# EAGLE design untitled (EAGLE 9.5.1)
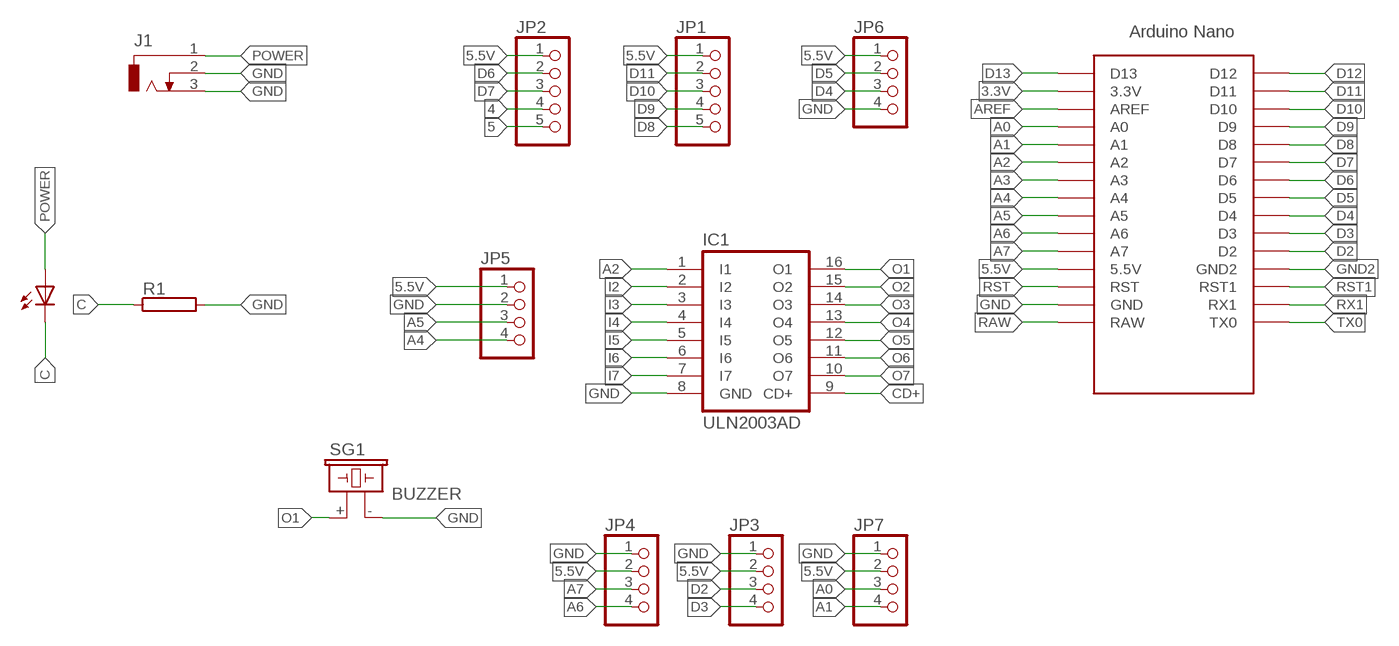
[diagram p0: schematic, sheet 1]

## Parts
IC1  ULN2003AD  [SO16]
J1  CON_JACK  [DCJ0303]
JP1  PINHD-1X5  [1X05]
JP2  PINHD-1X5  [1X05]
JP3  PINHD-1X4  [1X04]
JP4  PINHD-1X4  [1X04]
JP5  PINHD-1X4  [1X04]
JP6  PINHD-1X4  [1X04]
JP7  PINHD-1X4  [1X04]
R1  RMG100-H  [TO-247-2H]
SG1  BUZZER  [F/CM12P]
U$1  ARDUINO_NANO  [NANO]
U$2  LED5MM  [LED5MM]

## Nets
3.3V: U$1.3.3V
4: JP2.4
5: JP2.5
5.5V: JP1.1 JP2.1 JP3.2 JP4.2 JP5.1 JP6.1 JP7.2 U$1.5V(5.5V)
A0: JP7.3 U$1.A0
A1: JP7.4 U$1.A1
A2: IC1.1(I1) U$1.A2
A3: U$1.A3
A4: JP5.4 U$1.A4
A5: JP5.3 U$1.A5
A6: JP4.4 U$1.A6
A7: JP4.3 U$1.A7
AREF: U$1.AREF
C: R1.1 U$2.K(C)
CD+: IC1.9(CD+)
D2: JP3.3 U$1.D2
D3: JP3.4 U$1.D3
D4: JP6.3 U$1.D4
D5: JP6.2 U$1.D5
D6: JP2.2 U$1.D6
D7: JP2.3 U$1.D7
D8: JP1.5 U$1.D8
D9: JP1.4 U$1.D9
D10: JP1.3 U$1.D10
D11: JP1.2 U$1.D11
D12: U$1.D12
D13: U$1.D13
GND: IC1.8(GND) J1.2 J1.3 JP3.1 JP4.1 JP5.2 JP6.4 JP7.1 R1.2 SG1.- U$1.GND
GND2: U$1.GND1(GND2)
I2: IC1.2(I2)
I3: IC1.3(I3)
I4: IC1.4(I4)
I5: IC1.5(I5)
I6: IC1.6(I6)
I7: IC1.7(I7)
O1: IC1.16(O1) SG1.+
O2: IC1.15(O2)
O3: IC1.14(O3)
O4: IC1.13(O4)
O5: IC1.12(O5)
O6: IC1.11(O6)
O7: IC1.10(O7)
POWER: J1.1 U$2.A
RAW: U$1.RAW
RST: U$1.RST
RST1: U$1.RST1
RX1: U$1.RX1
TX0: U$1.TX0

## Library data of the parts
IC1 = MIA-Training:ULN2003A: DRIVER ARRAY
J1 = MIA-Training:CON_JACK: DC POWER JACK Source: DCJ0303.pdf; OC_FARNELL: unknown; OC_NEWARK: unknown
JP1 JP2 = MIA-Training:PINHD-1X5: PIN HEADER
JP3-JP7 = MIA-Training:PINHD-1X4: PIN HEADER
R1 = resistor-power:RMG100: TO-247 Power Resistor - RMG 100 Series Source: www.token.com.tw .. power-resistor-rmg100pdf; OC_FARNELL: unknown; OC_NEWARK: unknown
SG1 = MIA-Training:BUZZER: BUZZER Source: Buerklin; OC_FARNELL: unknown; OC_NEWARK: unknown
U$1 = MIA-Training:ARDUINO_NANO: Arduino Nano
U$2 = MIA-Training:LED5MM

## Board
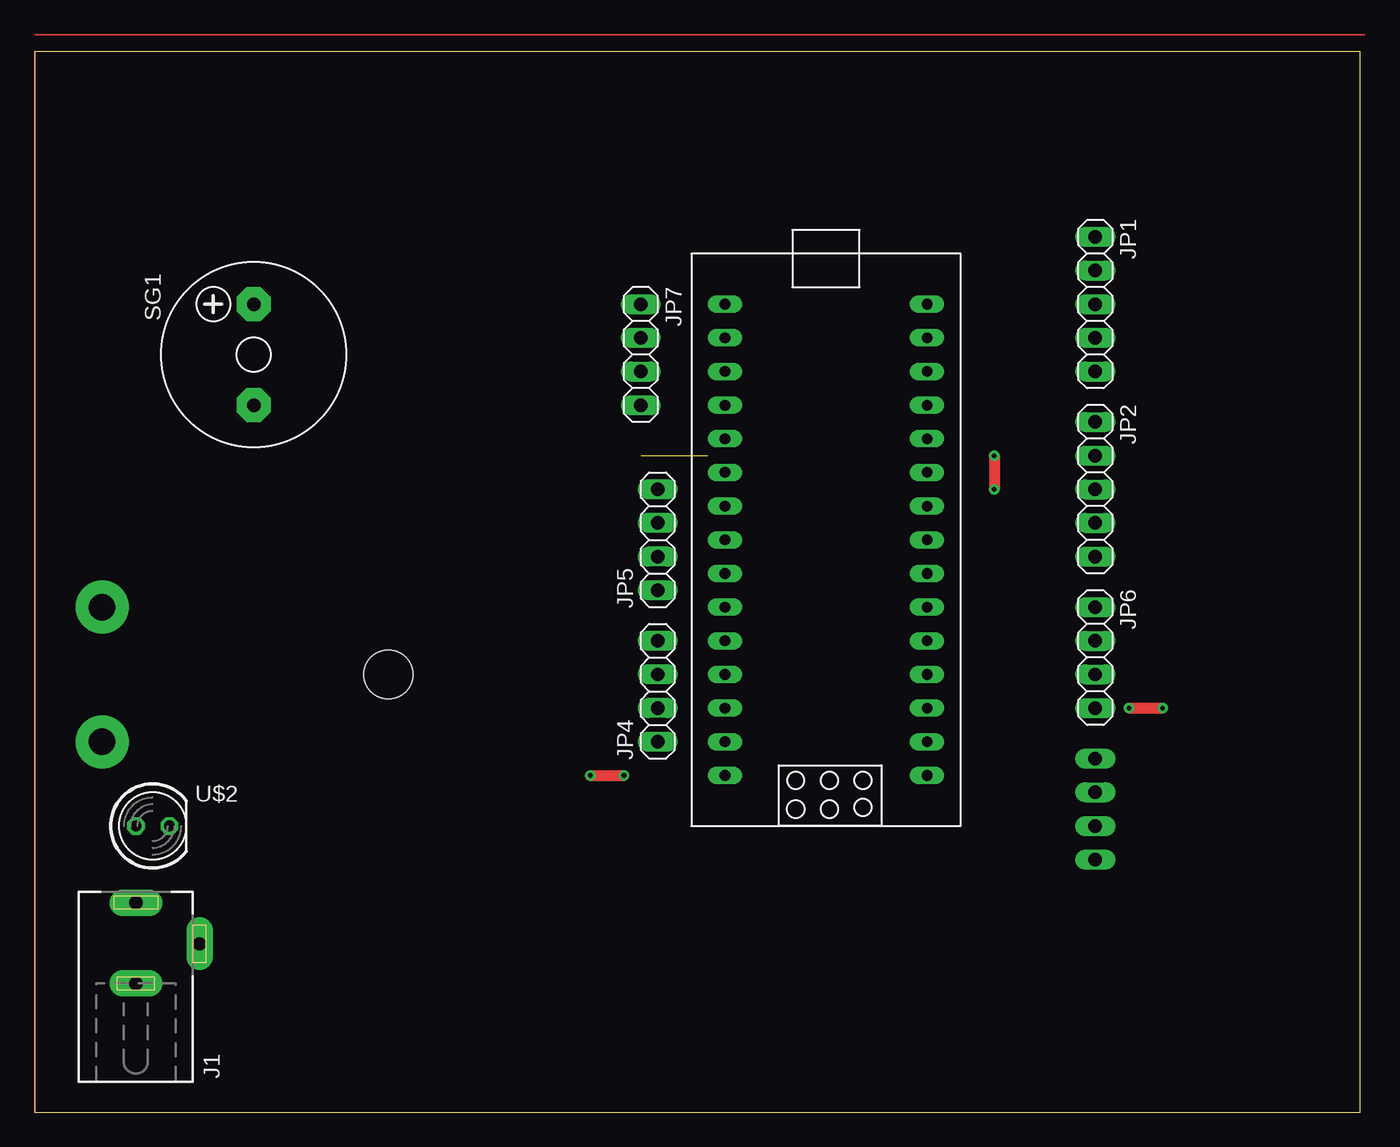
[diagram p1: board, top side]
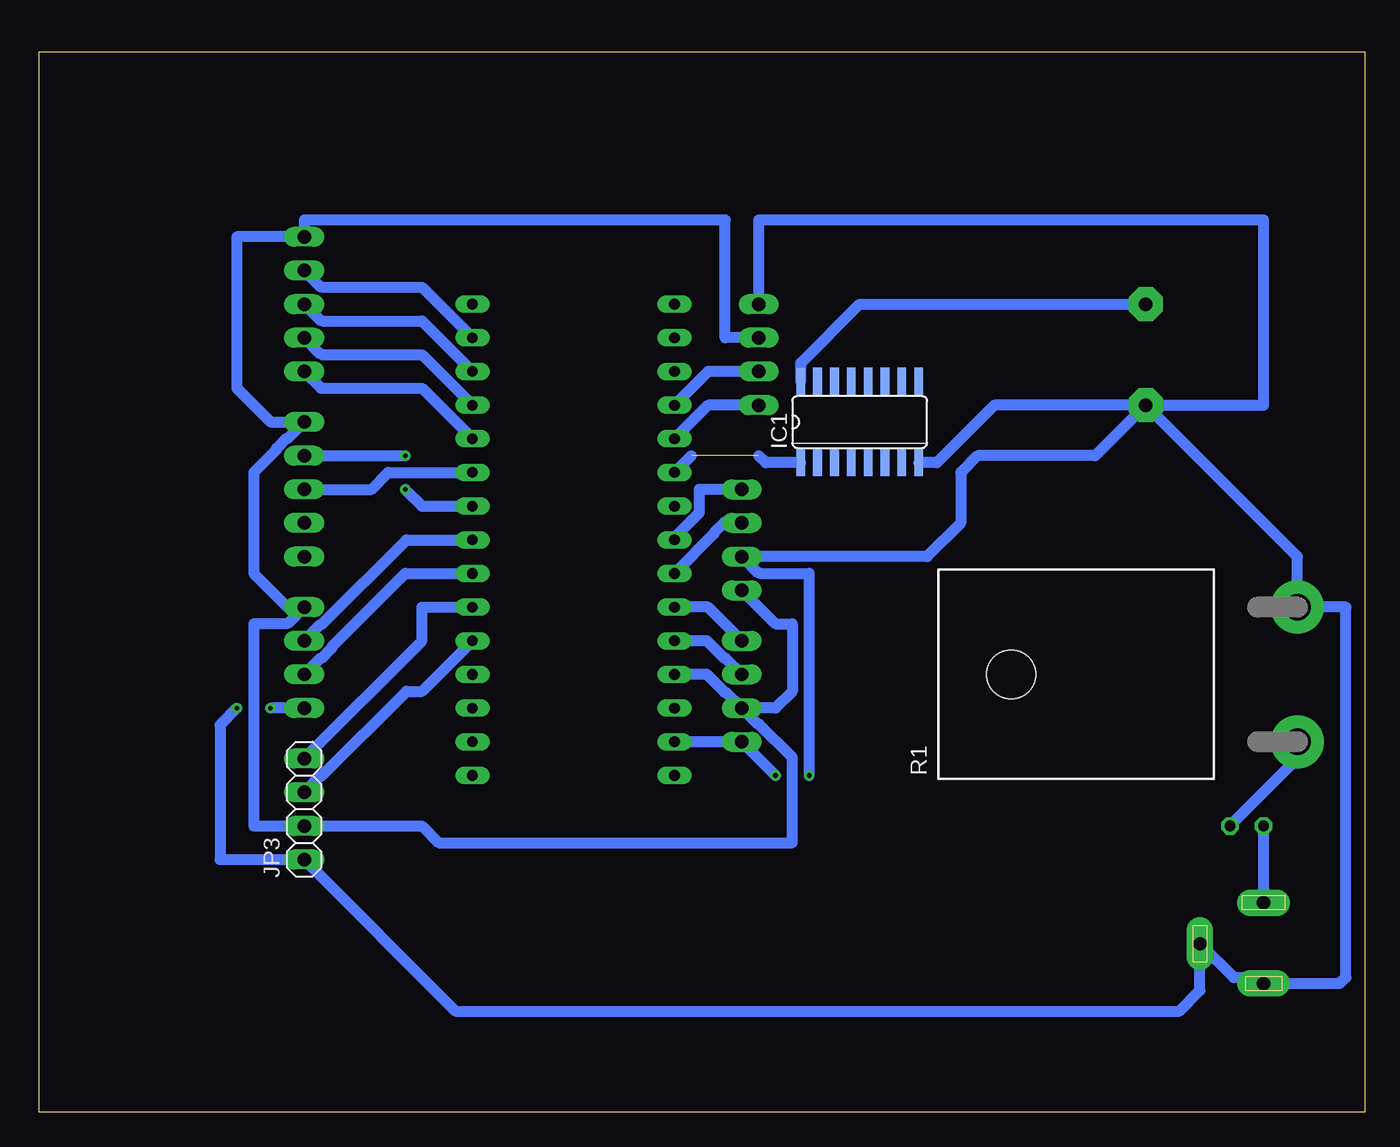
[diagram p2: board, bottom side, seen from below]

Size 100 x 80 mm. Coordinates in mm from the lower left corner, seen from the top.
Outline: 0,0 100,0 100,80 0,80 0,0
Copper layers (1*16): Top 0.035mm / dielectric 1.5mm / Bottom 0.035mm
Design rules "default": minimum track width 6mil, minimum drill 0.35mm, track to track 6mil, track to pad 6mil, pad to pad 6mil, via to via 6mil, smd to smd 6mil, copper to edge 40mil, drill to drill 6mil, minimum pad ring 10mil, minimum via ring 8mil, stop-mask expansion 4mil, vias tented up to drill 0mil, thermal gap 10mil

### Footprints (pad centres in the part's own frame; a part is rotated, then mirrored left to right if it is on the bottom)
SO16 = smd 0.66 x 2.032: 1 -4.445,-3.073; 2 -3.175,-3.073; 3 -1.905,-3.073; 4 -0.635,-3.073; 5 0.635,-3.073; 6 1.905,-3.073; 7 3.175,-3.073; 8 4.445,-3.073; 9 4.445,3.073; 10 3.175,3.073; 11 1.905,3.073; 12 0.635,3.073; 13 -0.635,3.073; 14 -1.905,3.073; 15 -3.175,3.073; 16 -4.445,3.073
DCJ0303 = drill 1 pad 2 long: 1 0,3.1; 2 4.8,0; 3 0,-3
1X05 = drill 1.016 long: 1 -5.08,0; 2 -2.54,0; 3 0,0; 4 2.54,0; 5 5.08,0
1X04 = drill 1.016 long: 1 -3.81,0; 2 -1.27,0; 3 1.27,0; 4 3.81,0
TO-247-2H = drill 2 pad 4: 1 -5.08,-21.59; 2 5.08,-21.59 | hole 3.7: 0,0
F/CM12P = drill 1.016 pad 2.54 octagon: + 3.81,0; - -3.81,0
NANO = drill 0.8 long: 3.3V -10.16,24.13; 5V -10.16,-1.27; A0 -10.16,19.05; A1 -10.16,16.51; A2 -10.16,13.97; A3 -10.16,11.43; A4 -10.16,8.89; A5 -10.16,6.35; A6 -10.16,3.81; A7 -10.16,1.27; AREF -10.16,21.59; D2 5.08,1.27; D3 5.08,3.81; D4 5.08,6.35; D5 5.08,8.89; D6 5.08,11.43; D7 5.08,13.97; D8 5.08,16.51; D9 5.08,19.05; D10 5.08,21.59; D11 5.08,24.13; D12 5.08,26.67; D13 -10.16,26.67; GND -10.16,-6.35; GND1 5.08,-1.27; RAW -10.16,-8.89; RST -10.16,-3.81; RST1 5.08,-3.81; RX1 5.08,-6.35; TX0 5.08,-8.89
LED5MM = drill 0.813 octagon: A -1.27,0; K 1.27,0

### Placement (x,y rotation side)
IC1  38.1,52.07 0 bottom
J1  7.62,12.7 0 top
JP1  80.01,60.96 270 top
JP2  80.01,46.99 270 top
JP3  80.01,22.86 90 bottom
JP4  46.99,31.75 90 top
JP5  46.99,43.18 90 top
JP6  80.01,34.29 270 top
JP7  45.72,57.15 270 top
R1  26.67,33.02 90 bottom
SG1  16.51,57.15 90 top
U$1  62.23,34.29 0 top
U$2  8.89,21.59 0 top

### Tracks (layer width: path | path; a pad name or v marks a point on that pad's centre or on a via)
5.5V
  Bottom 0.813: JP4.2 45.77,29.26 45.68,29.26 43.18,26.76 43.18,20.32 69.85,20.32 71.12,21.59 JP3.2 83.82,21.59 83.82,36.83 81.37,36.83 81.32,36.88 81.23,36.88 JP6.1 81.28,38.1 83.82,40.64 83.82,48.26 82.09,49.99 82.09,50.08 81.32,50.85 81.23,50.85 JP2.1 82.55,52.07 85.09,54.61 85.09,66.04 JP1.1 80.01,67.31 48.26,67.31 48.26,58.42 JP7.2 | JP4.2 48.21,31.7 48.3,31.7 49.62,33.02 U$1.5V | JP5.1 44.45,36.83 43.18,36.83 43.18,31.75 44.45,30.48 JP4.2
A0
  Bottom 0.813: JP7.3 49.53,55.88 U$1.A0
A1
  Bottom 0.813: JP7.4 49.53,53.34 U$1.A1
A2  (1 unrouted)
  Bottom 0.813: 50.8,49.53 U$1.A2 | IC1.1 45.19,49 45.72,49.53
A4
  Bottom 0.813: 48.26,46.99 JP5.4 50.2,46.99 50.2,45.22 52.07,43.35 U$1.A4
A5
  Bottom 0.813: JP5.3 47.04,44.5 48.3,44.5 49.07,43.73 49.07,43.64 U$1.A5
A6
  Bottom 0.813: JP4.4 49.53,38.1 U$1.A6
A7
  Bottom 0.813: JP4.3 48.21,34.24 48.3,34.24 49.62,35.56 U$1.A7
C
  Bottom 0.813: U$2.K 5.08,26.67 R1.1
D2
  Bottom 0.813: JP3.3 78.79,25.35 78.7,25.35 72.3,31.75 71.12,31.75 U$1.D2
D3
  Bottom 0.813: JP3.4 71.12,35.56 71.12,38.1 U$1.D3
D4
  Bottom 0.813: JP6.3 78.79,34.24 78.7,34.24 77.93,35.01 77.93,35.1 72.39,40.64 U$1.D4
D5
  Bottom 0.813: JP6.2 78.79,36.78 78.7,36.78 72.3,43.18 U$1.D5
D6  (via drill 0.35)
  Top 0.813: v72.39,49.53 v72.39,46.99
  Bottom 0.813: 67.31,45.89 U$1.D6 71.12,45.72 v72.39,46.99 | JP2.2 v72.39,49.53
D7
  Bottom 0.813: JP2.3 74.93,46.99 73.66,48.26 U$1.D7
D8
  Bottom 0.813: JP1.5 78.74,54.61 71.12,54.61 U$1.D8
D9
  Bottom 0.813: JP1.4 78.79,57.2 78.7,57.2 78.65,57.15 71.12,57.15 U$1.D9
D10
  Bottom 0.813: JP1.3 78.79,59.74 78.7,59.74 78.65,59.69 71.12,59.69 U$1.D10
D11
  Bottom 0.813: JP1.2 78.79,62.28 78.7,62.28 78.65,62.23 71.12,62.23 U$1.D11
GND  (via drill 0.35)
  Top 0.813: v41.91,25.4 v44.45,25.4 | v82.55,30.48 v85.09,30.48
  Bottom 0.813: SG1.- 5.08,41.91 R1.2 1.42,38.1 1.42,10.16 1.88,9.7 J1.3 7.62,10.16 9.88,10.16 J1.2 12.42,9.17 13.97,7.62 68.58,7.62 JP3.1 86.36,19.05 86.36,29.21 v85.09,30.48 | v44.45,25.4 JP4.1 U$1.GND | JP6.4 v82.55,30.48 | SG1.- 20.32,49.53 29.21,49.53 30.48,48.26 30.48,44.45 33.02,41.91 JP5.2 45.77,40.69 45.68,40.69 45.63,40.64 41.91,40.64 v41.91,25.4 | SG1.- 27.94,53.34 32.28,49 IC1.8 | JP7.1 45.72,67.31 7.62,67.31 7.62,53.34 SG1.-
O1
  Bottom 0.813: IC1.16 42.55,56.52 38.1,60.96 SG1.+
POWER
  Bottom 0.813: J1.1 U$2.A
(copper drawn outside any net)
  shapes: Top area x2